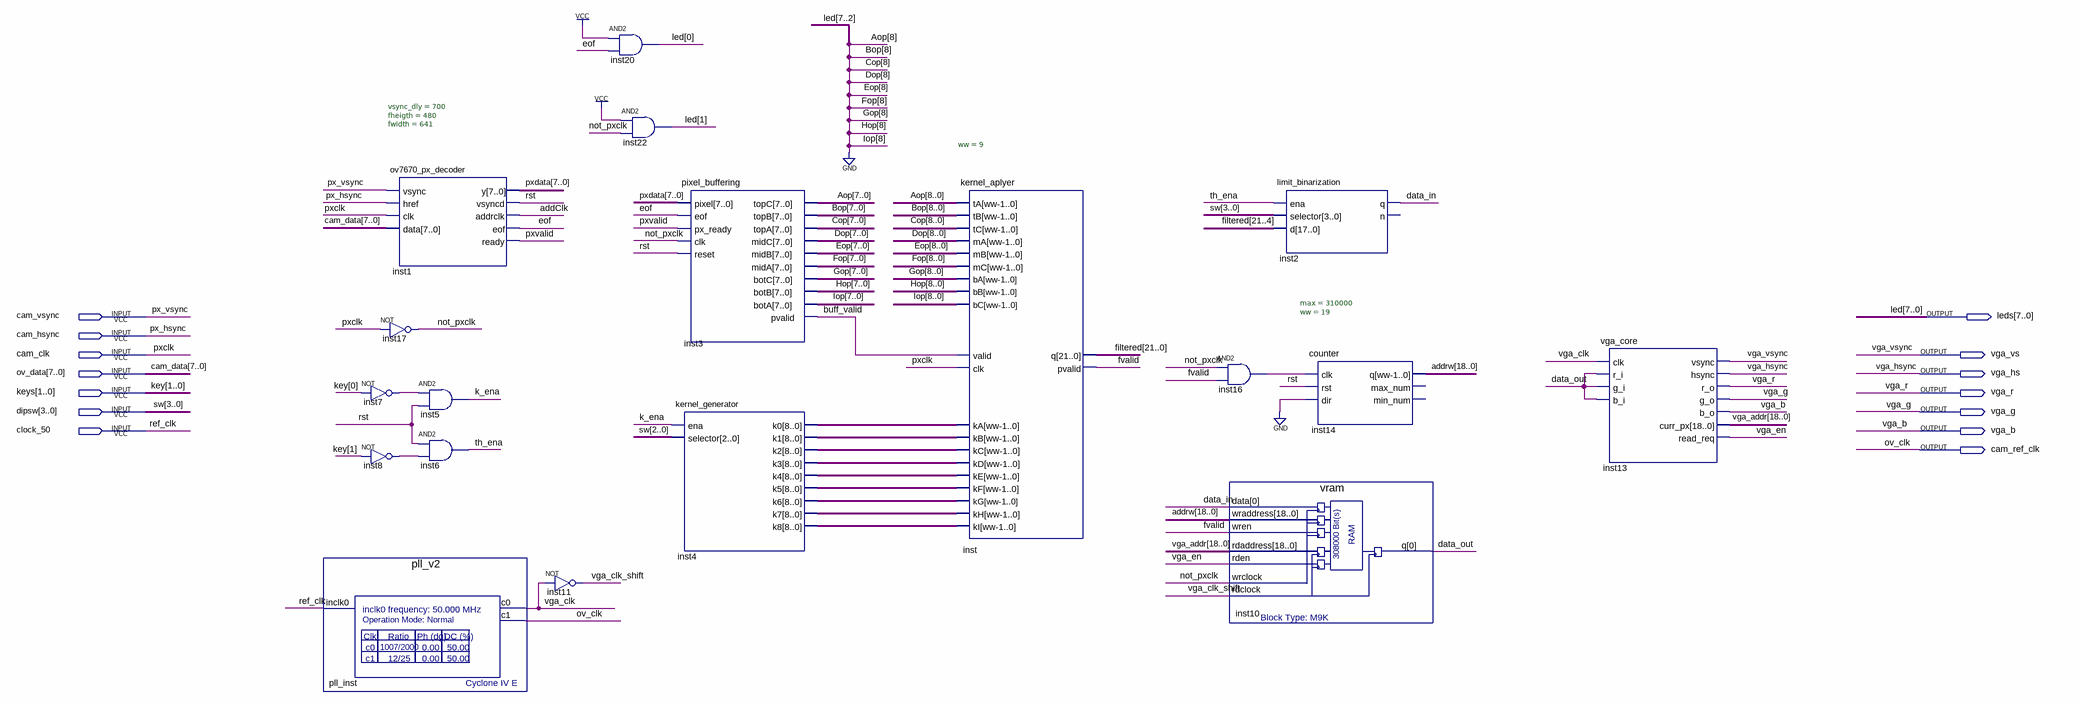
[diagram p0: schematic sheet]
// Quartus schematic image_filtering.bdf as structural Verilog: 18 symbols, 14 pins
module image_filtering (
  input  cam_vsync,
  input  cam_hsync,
  input  cam_clk,
  input  [7:0] ov_data,
  input  [1:0] keys,
  input  [3:0] dipsw,
  input  clock_50,
  output [7:0] leds,
  output vga_vs,
  output vga_hs,
  output vga_r,
  output vga_g,
  output vga_b,
  output cam_ref_clk
);

  wire addClk, buff_valid, data_in, data_out, eof, fvalid, inst7_out, inst8_out, inst16_out, k_ena,
       not_pxclk, pxvalid, rst, th_ena, vga_clk, vga_clk_shift, vga_en;
  wire [7:0] Bop, Cop, Dop, Eop, Fop, Gop, Hop, Iop, pxdata;
  wire [8:0] Aop, inst4_k0, inst4_k1, inst4_k2, inst4_k3, inst4_k4, inst4_k5, inst4_k6, inst4_k7, inst4_k8;
  wire [18:0] addrw, vga_addr;
  wire [21:0] filtered;

  pll_v2 pll_inst (.inclk0(clock_50), .c0(vga_clk), .c1(cam_ref_clk));
  ov7670_px_decoder #(.vsync_dly(700), .fheigth(480), .fwidth(641)) inst1 (
    .vsync(cam_vsync), .href(cam_hsync), .clk(cam_clk), .data(ov_data), .y(pxdata), .vsyncd(rst),
    .addrclk(addClk), .eof(eof), .ready(pxvalid));
  not inst17 (not_pxclk, cam_clk);
  not inst7 (inst7_out, keys[0]);
  not inst8 (inst8_out, keys[1]);
  and inst5 (k_ena, inst7_out, rst);
  and inst6 (th_ena, rst, inst8_out);
  not inst11 (vga_clk_shift, vga_clk);
  and inst20 (leds[0], 1'b1, eof);
  and inst22 (leds[1], 1'b1, not_pxclk);
  pixel_buffering inst3 (
    .pixel(pxdata), .eof(eof), .px_ready(pxvalid), .clk(not_pxclk), .reset(rst), .topC(Aop[7:0]), .topB(Bop),
    .topA(Cop), .midC(Dop), .midB(Eop), .midA(Fop), .botC(Gop), .botB(Hop), .botA(Iop), .pvalid(buff_valid));
  kernel_generator inst4 (
    .ena(k_ena), .selector(dipsw[2:0]), .k0(inst4_k0), .k1(inst4_k1), .k2(inst4_k2), .k3(inst4_k3),
    .k4(inst4_k4), .k5(inst4_k5), .k6(inst4_k6), .k7(inst4_k7), .k8(inst4_k8));
  kernel_aplyer #(.ww(9)) inst (
    .clk(cam_clk), .valid(buff_valid), .tA(Aop), .tB({1'b0, Bop}), .tC({1'b0, Cop}), .mA({1'b0, Dop}),
    .mB({1'b0, Eop}), .mC({1'b0, Fop}), .bA({1'b0, Gop}), .bB({1'b0, Hop}), .bC({1'b0, Iop}), .kA(inst4_k0),
    .kB(inst4_k1), .kC(inst4_k2), .kD(inst4_k3), .kE(inst4_k4), .kF(inst4_k5), .kG(inst4_k6), .kH(inst4_k7),
    .kI(inst4_k8), .q(filtered), .pvalid(fvalid));
  and inst16 (inst16_out, not_pxclk, fvalid);
  vram inst10 (
    .data(data_in), .wraddress(addrw), .wren(fvalid), .rdaddress(vga_addr), .rden(vga_en),
    .wrclock(not_pxclk), .rdclock(vga_clk_shift), .q(data_out));
  limit_binarization inst2 (.ena(th_ena), .selector(dipsw), .d(filtered[21:4]), .q(data_in));  // open: n
  counter #(.max(310000), .ww(19)) inst14 (
    .clk(inst16_out), .rst(rst), .dir(1'b0), .q(addrw));  // open: max_num, min_num
  vga_core inst13 (
    .clk(vga_clk), .r_i(data_out), .g_i(data_out), .b_i(data_out), .vsync(vga_vs), .hsync(vga_hs),
    .r_o(vga_r), .g_o(vga_g), .b_o(vga_b), .curr_px(vga_addr), .read_req(vga_en));

  // Other names for the same wires on the sheet: cam_data[7:0] = ov_data; key[1:0] = keys; led[7:0] = leds;
  //   ov_clk = cam_ref_clk; px_hsync = cam_hsync; px_vsync = cam_vsync; pxclk = cam_clk; ref_clk = clock_50;
  //   sw[3:0] = dipsw; vga_hsync = vga_hs; vga_vsync = vga_vs
endmodule
